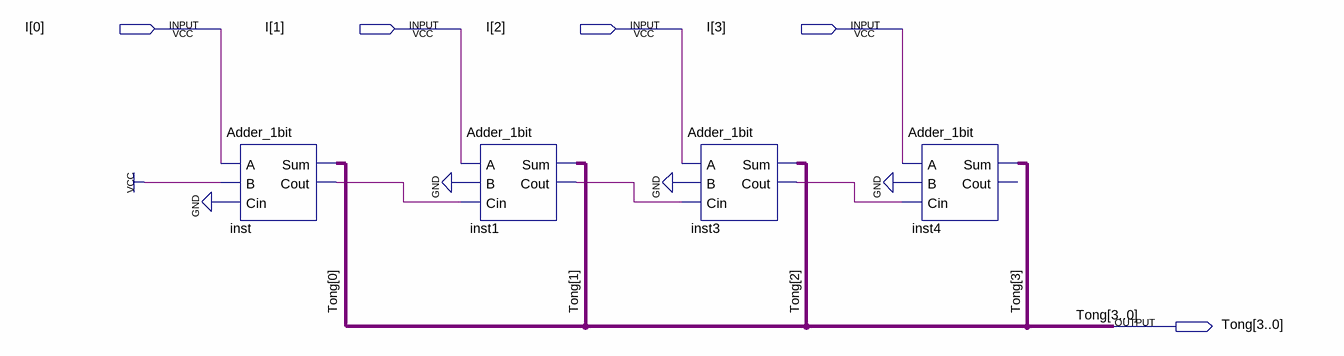
[diagram p0: schematic sheet]
// Quartus schematic Adder_upper_4bit.bdf as structural Verilog: 4 symbols, 5 pins
module Adder_upper_4bit (
  input  [3:0] I,
  output [3:0] Tong
);

  wire inst1_cout, inst3_cout, inst_cout;

  Adder_1bit inst (.A(I[0]), .B(1'b1), .Cin(1'b0), .Sum(Tong[0]), .Cout(inst_cout));
  Adder_1bit inst1 (.A(I[1]), .B(1'b0), .Cin(inst_cout), .Sum(Tong[1]), .Cout(inst1_cout));
  Adder_1bit inst3 (.A(I[2]), .B(1'b0), .Cin(inst1_cout), .Sum(Tong[2]), .Cout(inst3_cout));
  Adder_1bit inst4 (.A(I[3]), .B(1'b0), .Cin(inst3_cout), .Sum(Tong[3]));  // open: Cout
endmodule
